# Altium project vending-pad-002.PrjPcb
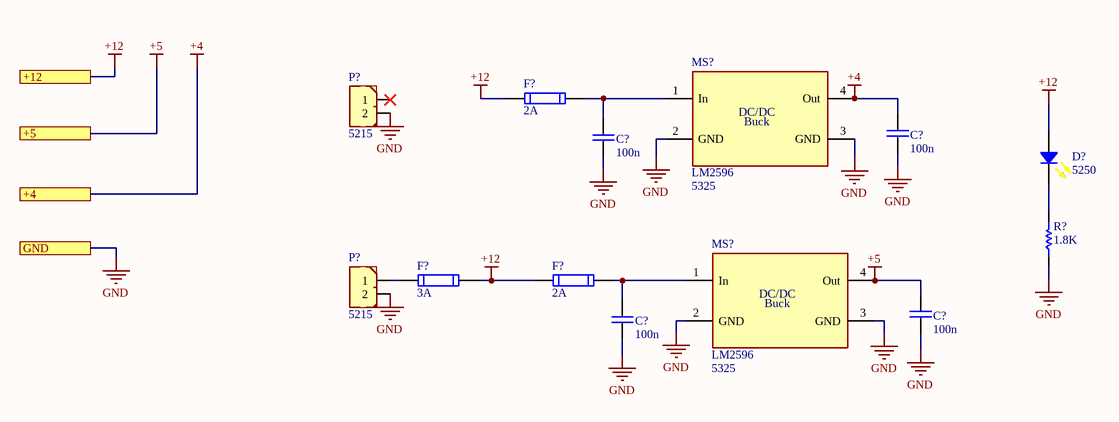
[diagram p0: Supply.SchDoc]
Revision: 1.0; Project_Name: vend_pad; CompanyName: rshahrami
6 sheets, 98 parts. Net scope: strictly hierarchical (ports join the sheet entries above them; power ports are local).
Board file: PCB.PcbDoc
Sheets:
  Supply.SchDoc
  GSM.SchDoc
  Motor.SchDoc
  GLCD.SchDoc
  Controller.SchDoc
  POS.SchDoc

## Sheet Supply.SchDoc
size A4; SheetNumber: 2; SheetTotal: 8; Time: Supply

### Parts
(Parts that share a designator on the sheet are numbered #1, #2 ... from top to bottom, then left to right.)
C?#1  100n  [CAP 1206/3216]
C?#2  100n  [CAP 1206/3216]
C?#3  100n  [CAP 1206/3216]
C?#4  100n  [CAP 1206/3216]
D?#1  Inflow: 5250  [LED 1206/3216 YELLOW]  (hidden comment: Yellow, 1206)
F?#1  2A  [1206_F]
F?#2  3A  [1206_F]
F?#3  2A  [1206_F]
MS?#1  Inflow: 5325  [LM2596_modsen]  (hidden comment: LM2596)
MS?#2  Inflow: 5325  [LM2596_modsen]  (hidden comment: LM2596)
P?#1  Inflow: 5215  [645002117322]  (hidden comment: 2'Pin)
P?#2  Inflow: 5215  [645002117322]  (hidden comment: 2'Pin)
R?#1  1.8K  [RES 1206 (3216X08L)]

### Ports
+4, +5, +12, GND

### Nets
+4: C?#2.1 MS?#1.4(Out) ; port +4
+5: C?#4.1 MS?#2.4(Out) ; port +5
+12: D?#1.1 F?#1.1 F?#2.2 F?#3.1 ; port +12
GND: C?#1.2 C?#2.2 C?#3.2 C?#4.2 MS?#1.2(GND) MS?#1.3(GND) MS?#2.2(GND) MS?#2.3(GND) P?#1.2 P?#2.2 R?#1.1 ; port GND
NetC?#1_1: C?#1.1 F?#1.2 MS?#1.1(In)
NetC?#3_1: C?#3.1 F?#3.2 MS?#2.1(In)
NetD?#1_2: D?#1.2 R?#1.2
NetF?#2_1: F?#2.1 P?#2.1

Not connected (* = marked no-connect by the designer): P?#1 1*

### Notes on the sheet
- Title:
- Project:
- Drawn by:
- Revision:
- Hossein Bagheri
- Company:
- Sheet
- of
- (in symbol ModSen_LM2596) DC/DC; Buck

### Library data of the parts
C?#1-C?#4 = Cap_Multi_SMD_100nF_1206: Bipolar ceramic capacitor SMD; Type: MultiLayer; Inflow: inflow?; Rating: 50V; Validation: Valid; Package: 1206; Value: 100n
D?#1 = Semi_LED_Yellow_1206: LED; Rating: Rating?; Type: Type?; Validation: Valid; Value: Yellow, 1206; Package: Package?
F?#1-F?#3 = Other_Elec_Fuse_SMD: Short circiut  protection; Inflow: inflow?; Type: Fast; Rating: Rating?; Validation: Valid; Package: 1206
  F?#1 F?#3: Value: 2A
  F?#2: Value: 3A
MS?#1 MS?#2 = ModSen_LM2596: DC to DC Buck converter 1.23V-30V 3A; Rating: Rating?; Validation: Valid; Package: Package?; Type: Type?; Value: LM2596
P?#1 P?#2 = Con_Power_2_PC_H: 2'Pin Power Connector; Rating: Rating?; Validation: Valid; Value: 2'Pin; Package: Package?; Type: Type?
R?#1 = Res_SMD_1206: Resistor; Inflow: inflow?; Rating: 0.25W; Validation: Valid; Package: 1206; Type: 10%; Value: 1.8K

## Sheet GSM.SchDoc
size A4; SheetNumber: 4; SheetTotal: 7
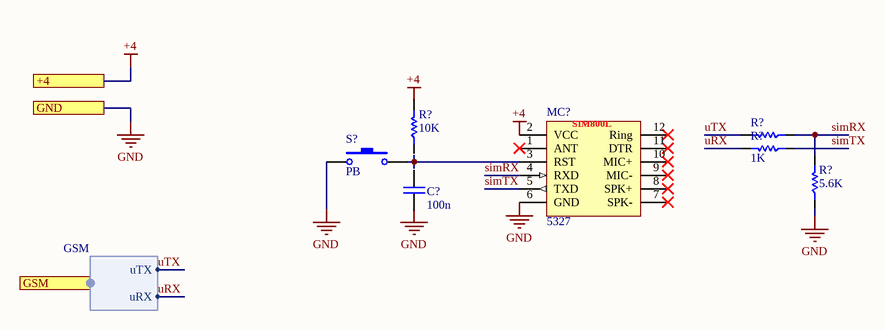
[diagram p1: GSM.SchDoc]

### Parts
(Parts that share a designator on the sheet are numbered #1, #2 ... from top to bottom, then left to right.)
C?#5  100n  [CAP 1206/3216]
MC?  Inflow: 5327  [Sim800L_Module]  (hidden comment: Sim800L)
R?#2  47K  [RES 1206 (3216X08L)]  (value not drawn)
R?#3  1K  [RES 1206 (3216X08L)]
R?#4  10K  [RES 1206 (3216X08L)]
R?#5  5.6K  [RES 1206 (3216X08L)]
S?#1  PB  [SW_PB_SMD_2PIN_SPST_6X3X2]

### Ports
+4, GND, GSM (harness GSM)

### Harnesses
GSM: uTX, uRX

### Nets
+4: MC?.2(VCC) ; port +4
GND: MC?.6(GND) R?#5.1 S?#1.2 ; port GND
simRX: MC?.4(RXD) R?#2.1 R?#5.2
simTX: MC?.5(TXD) R?#3.1
uRX: R?#3.2 ; port GSM.uRX
uTX: R?#2.2 ; port GSM.uTX
NetMC?_3: MC?.3(RST) S?#1.1

Not connected (* = marked no-connect by the designer): C?#5 1 2; MC? 1(ANT)* 7(SPK-)* 8(SPK+)* 9(MIC-)* 10(MIC+)* 11(DTR)* 12(Ring)*; R?#4 1 2

### Notes on the sheet
- Labels drawn without touching a wire or pin: +4, GND
- (in symbol ModSen_Com_Sim800L) SIM800L

### Library data of the parts
C?#5 = Cap_Multi_SMD_100nF_1206: as C?#1 on sheet Supply; Package: 1206; Value: 100n
MC? = ModSen_Com_Sim800L: SimCom GSM/GPRS Module; Rating: Rating?; Validation: NT; Value: Sim800L; Package: Dip; Type: GSM-GPRS
R?#2-R?#5 = Res_SMD_1206: as R?#1 on sheet Supply; Package: 1206; Type: 10%
  R?#2: Value: 47K
  R?#3: Value: 1K
  R?#4: Value: 10K
  R?#5: Value: 5.6K
S?#1 = SW_PushButton_2_SMD: SMT Tactile ‎Switch; Rating: 2b; Validation: Valid; Inflow: 8260; Type: Vertical; Package: SMD; Value: PB

## Sheet Motor.SchDoc
size A4; SheetNumber: 4; SheetTotal: 7
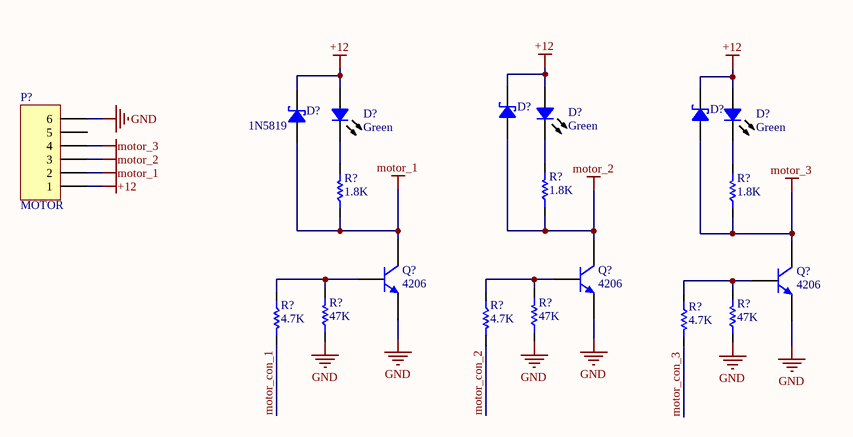
[diagram p2: Motor.SchDoc]

### Parts
(Parts that share a designator on the sheet are numbered #1, #2 ... from top to bottom, then left to right.)
D?#2  Green  [LED 0805/2012 GREEN]
D?#3  Green  [LED 0805/2012 GREEN]
D?#4  Green  [LED 0805/2012 GREEN]
D?#5  1N5819  [430X270D]
D?#6  1N5819  [430X270D]  (value not drawn)
D?#7  1N5819  [430X270D]  (value not drawn)
P?#3  MOTOR  [MO-Header 6]
Q?#1  Inflow: 4206  [TO-220 AB]  (hidden comment: NPN)
Q?#2  Inflow: 4206  [TO-220 AB]  (hidden comment: NPN)
Q?#3  Inflow: 4206  [TO-220 AB]  (hidden comment: NPN)
R?#6  1.8K  [RES 0805 (2012X06L)]
R?#7  1.8K  [RES 0805 (2012X06L)]
R?#8  1.8K  [RES 0805 (2012X06L)]
R?#9  4.7K  [RES 1206 (3216X08L)]
R?#10  4.7K  [RES 1206 (3216X08L)]
R?#11  4.7K  [RES 1206 (3216X08L)]
R?#12  47K  [RES 1206 (3216X08L)]
R?#13  47K  [RES 1206 (3216X08L)]
R?#14  47K  [RES 1206 (3216X08L)]

### Nets
+12: D?#2.1 D?#3.1 D?#4.1 D?#5.2 D?#6.2 D?#7.2 P?#3.1
GND: P?#3.6 Q?#1.3(E) Q?#2.3(E) Q?#3.3(E) R?#12.1 R?#13.1 R?#14.1
motor_1: D?#5.1 P?#3.2 Q?#1.2(C) R?#6.1
motor_2: D?#6.1 P?#3.3 Q?#2.2(C) R?#7.1
motor_3: D?#7.1 P?#3.4 Q?#3.2(C) R?#8.1
motor_con_1: R?#9.2
motor_con_2: R?#10.2
motor_con_3: R?#11.2
NetD?#2_2: D?#2.2 R?#6.2
NetD?#3_2: D?#3.2 R?#7.2
NetD?#4_2: D?#4.2 R?#8.2
NetQ?#1_1: Q?#1.1(B) R?#9.1 R?#12.2
NetQ?#2_1: Q?#2.1(B) R?#10.1 R?#13.2
NetQ?#3_1: Q?#3.1(B) R?#11.1 R?#14.2

Not connected (* = marked no-connect by the designer): P?#3 5

### Library data of the parts
D?#2-D?#4 = Semi_LED_SMD: LED; Inflow: inflow?; Rating: Rating?; Validation: Valid; Package: Package?; Type: LED; Value: Green
D?#5-D?#7 = Semi_Diod_Sch_1N5819_SMD: Schottky Rectifiers; Rating: Rating?; Validation: Valid; Inflow: inflow?; Package: SMA; Type: Schottky; Value: 1N5819
P?#3 = MO-Header 6
Q?#1-Q?#3 = Semi_BJT_TIP41C: NPN Power transistor; Rating: Rating?; Type: Type?; Validation: NT; Value: NPN; Package: Package?
R?#6-R?#8 = Res_SMD_0805: Resistor; Inflow: inflow?; Rating: 0.125W; Validation: Valid; Package: 0805; Type: 10%; Value: 1.8K
R?#9-R?#14 = Res_SMD_1206: as R?#1 on sheet Supply; Package: 1206; Type: 10%
  R?#9-R?#11: Value: 4.7K
  R?#12-R?#14: Value: 47K

## Sheet GLCD.SchDoc
size A4; SheetNumber: 5; SheetTotal: 7
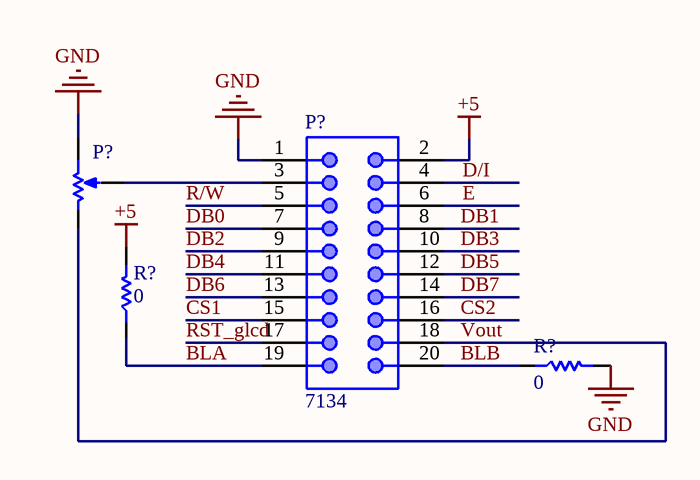
[diagram p3: GLCD.SchDoc]

### Parts
(Parts that share a designator on the sheet are numbered #1, #2 ... from top to bottom, then left to right.)
P?#4  Inflow: 7134  [BOX-HDR-10X2-2.54mm-S]  (hidden comment: 10x2)
P?#5  10K  [Multi turn 01]  (value not drawn)
R?#15  0  [RES 1206 (3216X08L)]
R?#16  0  [RES 1206 (3216X08L)]

### Nets
+5: P?#4.2 R?#15.2
GND: P?#4.1 P?#5.1 R?#16.2
BLA: P?#4.19 R?#15.1
BLB: P?#4.20 R?#16.1
CS1: P?#4.15
CS2: P?#4.16
D/I: P?#4.4
DB0: P?#4.7
DB1: P?#4.8
DB2: P?#4.9
DB3: P?#4.10
DB4: P?#4.11
DB5: P?#4.12
DB6: P?#4.13
DB7: P?#4.14
E: P?#4.6
R/W: P?#4.5
RST_glcd: P?#4.17
Vout: P?#4.18 P?#5.3
NetP?#4_3: P?#4.3 P?#5.2

### Library data of the parts
P?#4 = Con_IDC_10x2: Male Box Header, 20 pins; Rating: Rating?; Validation: NT; Value: 10x2; Package: Package?; Type: Type?
P?#5 = Res_Multi: Multi Turn; Rating: Rating?; Validation: Valid; Inflow: inflow?; Package: Package?; Type: Type?; Value: 10K
R?#15 R?#16 = Res_SMD_1206: as R?#1 on sheet Supply; Package: 1206; Type: 10%; Value: 0

## Sheet Controller.SchDoc
size A4; SheetNumber: 2; SheetTotal: 8
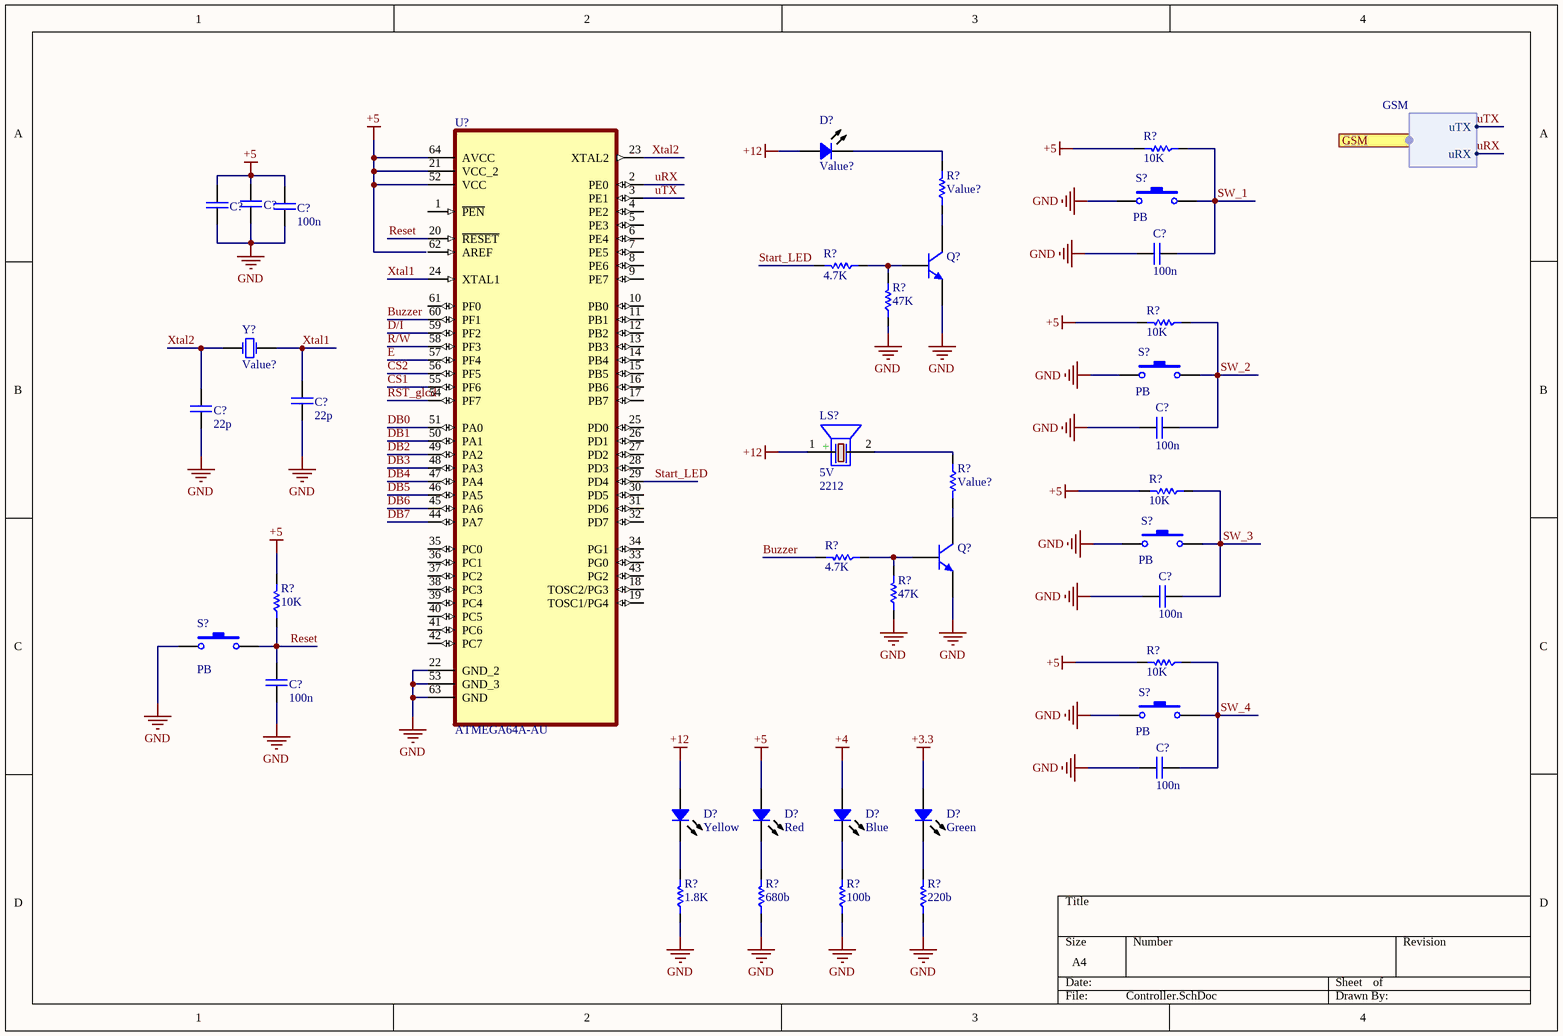
[diagram p4: Controller.SchDoc]

### Parts
(Parts that share a designator on the sheet are numbered #1, #2 ... from top to bottom, then left to right.)
C?#6  (no value)  [CAP 1206/3216]
C?#7  (no value)  [CAP 1206/3216]
C?#8  100n  [CAP 1206/3216]
C?#9  100n  [CAP 1206/3216]
C?#10  22p  [CAP 1206/3216]
C?#11  22p  [CAP 1206/3216]
C?#12  100n  [CAP 1206/3216]
C?#13  100n  [CAP 1206/3216]
C?#14  100n  [CAP 1206/3216]
C?#15  100n  [CAP 1206/3216]
D?#8  Value?  [LED 1206/3216 GREEN]
D?#9  Yellow  [LED 0805/2012 YELLOW]
D?#10  Red  [LED 0805/2012 RED]
D?#11  Blue  [LED 0805/2012 BLUE]
D?#12  Green  [LED 0805/2012 GREEN]
LS?  Inflow: 2212  [BZ_SJ]  (hidden comment: 5V)
Q?#4  NPN  [SOT23_N]  (value not drawn)
Q?#5  NPN  [SOT23_N]  (value not drawn)
R?#17  10K  [RES 1206 (3216X08L)]
R?#18  Value?  [RES 1206 (3216X08L)]
R?#19  4.7K  [RES 1206 (3216X08L)]
R?#20  10K  [RES 1206 (3216X08L)]
R?#21  47K  [RES 1206 (3216X08L)]
R?#22  Value?  [RES 1206 (3216X08L)]
R?#23  10K  [RES 1206 (3216X08L)]
R?#24  4.7K  [RES 1206 (3216X08L)]
R?#25  47K  [RES 1206 (3216X08L)]
R?#26  10K  [RES 1206 (3216X08L)]
R?#27  10K  [RES 1206 (3216X08L)]
R?#28  1.8K  [RES 0805 (2012X06L)]
R?#29  680b  [RES 0805 (2012X06L)]
R?#30  100b  [RES 0805 (2012X06L)]
R?#31  220b  [RES 0805 (2012X06L)]
S?#2  PB  [SW_PB_SMD_2PIN_SPST_6X3X2]
S?#3  PB  [SW_PB_SMD_2PIN_SPST_6X3X2]
S?#4  PB  [SW_PB_SMD_2PIN_SPST_6X3X2]
S?#5  PB  [SW_PB_SMD_2PIN_SPST_6X3X2]
S?#6  PB  [SW_PB_SMD_2PIN_SPST_6X3X2]
U?#1  ATMEGA64A-AU  [QFP80P1600X1600X120-64N]
Y?  Value?  [XTAL Small]

### Ports
GSM (harness GSM)

### Harnesses
GSM: uTX, uRX

### Nets
+3.3: D?#12.1
+4: D?#11.1
+5: C?#6.1 C?#7.1 C?#8.1 D?#10.1 R?#17.2 R?#20.2 R?#23.2 R?#26.2 R?#27.2 U?#1.21(VCC_2) U?#1.52(VCC) U?#1.64(AVCC)
+12: D?#8.1 D?#9.1 LS?.1(+)
GND: C?#6.2 C?#7.2 C?#8.2 C?#9.2 C?#10.2 C?#11.2 C?#12.2 C?#13.2 C?#14.2 C?#15.2 Q?#4.2(E) Q?#5.2(E) R?#21.1 R?#25.1 R?#28.1 R?#29.1 R?#30.1 R?#31.1 S?#2.1 S?#3.1 S?#4.1 S?#5.1 S?#6.1 U?#1.22(GND_2) U?#1.53(GND_3) U?#1.63(GND)
Buzzer: R?#24.2 U?#1.60(PF1)
CS1: U?#1.55(PF6)
CS2: U?#1.56(PF5)
D/I: U?#1.59(PF2)
DB0: U?#1.51(PA0)
DB1: U?#1.50(PA1)
DB2: U?#1.49(PA2)
DB3: U?#1.48(PA3)
DB4: U?#1.47(PA4)
DB5: U?#1.46(PA5)
DB6: U?#1.45(PA6)
DB7: U?#1.44(PA7)
E: U?#1.57(PF4)
R/W: U?#1.58(PF3)
Reset: C?#14.1 R?#26.1 S?#5.2 U?#1.20(~{RESET})
RST_glcd: U?#1.54(PF7)
Start_LED: R?#19.2 U?#1.29(PD4)
SW_1: C?#9.1 R?#17.1 S?#2.2
SW_2: C?#12.1 R?#20.1 S?#3.2
SW_3: C?#13.1 R?#23.1 S?#4.2
SW_4: C?#15.1 R?#27.1 S?#6.2
uRX: U?#1.2(PE0) ; port GSM.uRX
uTX: U?#1.3(PE1) ; port GSM.uTX
Xtal1: C?#10.1 U?#1.24(XTAL1) Y?.2(OSC2)
Xtal2: C?#11.1 U?#1.23(XTAL2) Y?.1(OSC1)
NetD?#8_2: D?#8.2 R?#18.2
NetD?#9_2: D?#9.2 R?#28.2
NetD?#10_2: D?#10.2 R?#29.2
NetD?#11_2: D?#11.2 R?#30.2
NetD?#12_2: D?#12.2 R?#31.2
NetLS?_2: LS?.2(-) R?#22.1
NetQ?#4_1: Q?#4.1(B) R?#19.1 R?#21.2
NetQ?#4_3: Q?#4.3(C) R?#18.1
NetQ?#5_1: Q?#5.1(B) R?#24.1 R?#25.2
NetQ?#5_3: Q?#5.3(C) R?#22.2

Not connected (* = marked no-connect by the designer): U?#1 1(~{PEN}) 4(PE2) 5(PE3) 6(PE4) 7(PE5) 8(PE6) 9(PE7) 10(PB0) 11(PB1) 12(PB2) 13(PB3) 14(PB4) 15(PB5) 16(PB6) 17(PB7) 18(TOSC2/PG3) 19(TOSC1/PG4) 25(PD0) 26(PD1) 27(PD2) 28(PD3) 30(PD5) 31(PD6) 32(PD7) 33(PG0) 34(PG1) 35(PC0) 36(PC1) 37(PC2) 38(PC3) 39(PC4) 40(PC5) 41(PC6) 42(PC7) 43(PG2) 61(PF0) 62(AREF)

### Library data of the parts
C?#6-C?#15 = Cap_Multi_SMD_100nF_1206: as C?#1 on sheet Supply; Package: 1206
  C?#8 C?#9 C?#12-C?#15: Value: 100n
  C?#10 C?#11: Value: 22p
D?#8-D?#12 = Semi_LED_SMD: as D?#2 on sheet Motor; Package: Package?; Type: LED
  D?#8: Value: Value?
  D?#9: Value: Yellow
  D?#10: Value: Red
  D?#11: Value: Blue
  D?#12: Value: Green
LS? = Other_Elec_Buzzer: Magnetic Transducer Buzzer; Rating: 12mm; Validation: Valid; Type: Buzzer; Package: Dip; Value: 5V
Q?#4 Q?#5 = Semi_BJT_BC817: NPN General purpose Transistor; Rating: Rating?; Type: Type?; Validation: Valid; Inflow: inflow?; Value: NPN; Package: Package?
R?#17-R?#27 = Res_SMD_1206: as R?#1 on sheet Supply; Package: 1206; Type: 10%
  R?#17 R?#20 R?#23 R?#26 R?#27: Value: 10K
  R?#18 R?#22: Value: Value?
  R?#19 R?#24: Value: 4.7K
  R?#21 R?#25: Value: 47K
R?#28-R?#31 = Res_SMD_0805: as R?#6 on sheet Motor; Package: 0805; Type: 10%
  R?#28: Value: 1.8K
  R?#29: Value: 680b
  R?#30: Value: 100b
  R?#31: Value: 220b
S?#2-S?#6 = SW_PushButton_2_SMD: as S?#1 on sheet GSM; Type: Vertical; Package: SMD; Value: PB
U?#1 = ATMEGA64A-AU: AVR AVRÂ® ATmega Microcontroller IC 8-Bit 16MHz 64KB (32K x 16) FLASH 64-TQFP (14x14); MF: Microchip; SnapEDA_Link: https://www.snapeda.com/parts/ATMEGA64A-AU/Microchip/view-part/?ref=snap; Package: TQFP-64 Microchip; Value: *; MP: ATMEGA64A-AU; Check_prices: https://www.snapeda.com/parts/ATMEGA64A-AU/Microchip/view-part/?ref=eda
Y? = Other_Elec_Xtal_THT: Crystal Oscillator; Rating: Rating?; Inflow: inflow?; Validation: Valid; Type: Quartz; Package: Dip; Value: Value?

## Sheet POS.SchDoc
size A4; SheetNumber: 7; SheetTotal: 7
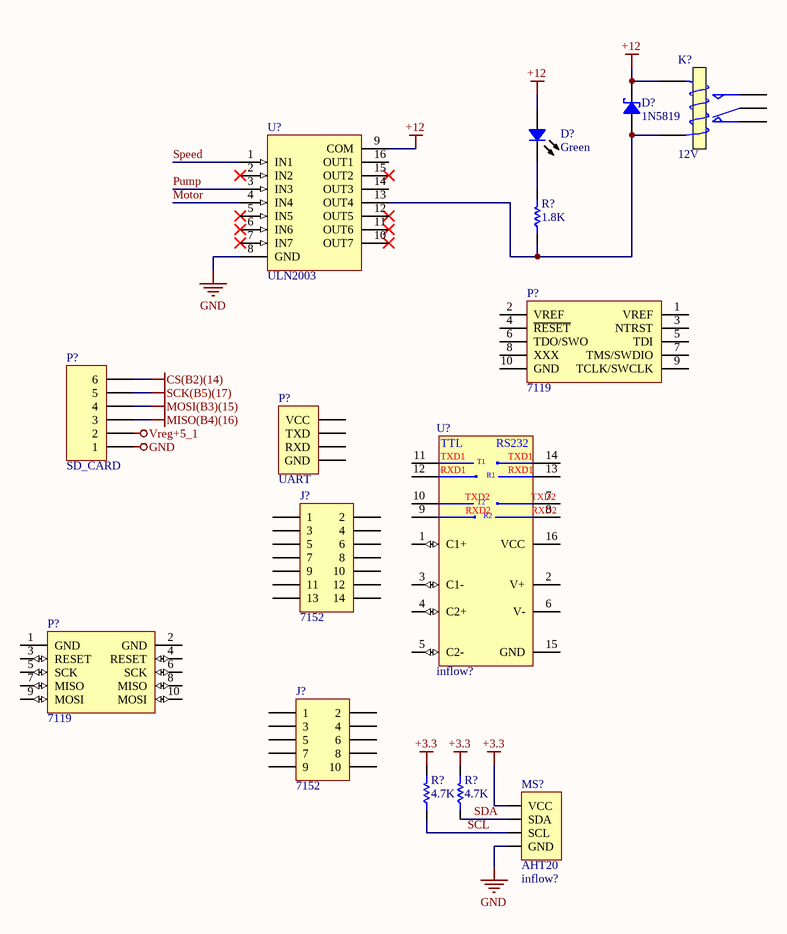
[diagram p5: POS.SchDoc]

### Parts
(Parts that share a designator on the sheet are numbered #1, #2 ... from top to bottom, then left to right.)
D?#13  Green  [LED 0805/2012 GREEN]
D?#14  1N5819  [430X270D]
J?#1  Inflow: 7152  [HDR_THT_7x2M_2.54mm]  (hidden comment: 7x2)
J?#2  Inflow: 7152  [HDR_THT_5x2M_2.54mm]  (hidden comment: 5x2)
K?  12V  [Relay 18.85x15.35x15.70]
MS?#3  Inflow: inflow?  [AHT20]  (hidden comment: AHT20)
P?#6  Inflow: 7119  [IDC2.54-10PIN]  (hidden comment: JTAG-10P)
P?#7  UART  [MOLEX KK 0022272041]
P?#8  SD_CARD  [MO-Header 6]
P?#9  Inflow: 7119  [IDC2.54-10PIN]  (hidden comment: JTAG, 10'Pin)
R?#32  1.8K  [RES 0805 (2012X06L)]
R?#33  4.7K  [RES 0805 (2012X06L)]
R?#34  4.7K  [RES 0805 (2012X06L)]
U?#2  ULN2003  [SO16_M]
U?#3  Inflow: inflow?  [NSO16_M]  (hidden comment: MAX3232)

### Nets
+3.3: MS?#3.4(VCC) R?#33.2 R?#34.2
+12: D?#13.1 D?#14.2 K?.5(T2) U?#2.9(COM)
CS(B2)(14): P?#8.6
GND: MS?#3.3(GND) P?#8.1 U?#2.8(GND)
MISO(B4)(16): P?#8.3
MOSI(B3)(15): P?#8.4
SCK(B5)(17): P?#8.5
Vreg+5_1: P?#8.2
Motor: U?#2.4(IN4)
Pump: U?#2.3(IN3)
SCL: MS?#3.2(SCL) R?#33.1
SDA: MS?#3.1(SDA) R?#34.1
Speed: U?#2.1(IN1)
NetD?#13_2: D?#13.2 R?#32.2
NetD?#14_1: D?#14.1 K?.4(T1) R?#32.1 U?#2.13(OUT4)

Not connected (* = marked no-connect by the designer): J?#1 1 2 3 4 5 6 7 8 9 10 11 12 13 14; J?#2 1 2 3 4 5 6 7 8 9 10; K? 1(COM) 2(NC) 3(NO); P?#6 1(VREF) 2(VREF) 3(NTRST) 4(~{RESET}) 5(TDI) 6(TDO/SWO) 7(TMS/SWDIO) 8(XXX) 9(TCLK/SWCLK) 10(GND); P?#7 1(VCC) 2(TXD) 3(RXD) 4(GND); P?#9 1(GND) 2(GND) 3(RESET) 4(RESET) 5(SCK) 6(SCK) 7(MISO) 8(MISO) 9(MOSI) 10(MOSI); U?#2 2(IN2)* 5(IN5)* 6(IN6)* 7(IN7)* 10(OUT7)* 11(OUT6)* 12(OUT5)* 14(OUT3) 15(OUT2)* 16(OUT1); U?#3 1(C1+) 2(V+) 3(C1-) 4(C2+) 5(C2-) 6(V-) 7(T2OUT) 8(R2IN) 9(R2OUT) 10(T2IN) 11(T1IN) 12(R1OUT) 13(R1IN) 14(T1OUT) 15(GND) 16(VCC)

### Notes on the sheet
- (in symbol IC_Converter_MAX3232CSE) TTL; TXD1; T1; RXD1; R1; TXD2; T2; RXD2; R2

### Library data of the parts
D?#13 = Semi_LED_SMD: as D?#2 on sheet Motor; Package: Package?; Type: LED; Value: Green
D?#14 = Semi_Diod_Sch_1N5819_SMD: as D?#5 on sheet Motor; Package: SMA; Type: Schottky; Value: 1N5819
J?#1 = Con_MPH_7x2_V_THT_2.54: Header, dual row, 14 pin; Rating: Rating?; Validation: NT; Value: 7x2; Package: Package?; Type: Type?
J?#2 = Con_MPH_5x2_V_THT_2.54: Header, dual row, 10 pin; Rating: Rating?; Validation: NT; Value: 5x2; Package: Package?; Type: Type?
K? = SW_Relay_SPDT: SPDT Relay; Rating: Rating?; Validation: Valid; Inflow: inflow?; Type: SPDT; Package: Dip; Value: 12V
MS?#3 = ModSen_AHT20: Air Temperature and Humidity Sensor; Rating: Rating?; Validation: NT; Package: Dip; Type: Air T&H; Value: AHT20
P?#6 = Con_Prog_JTAG_10: 10 Pin Standard JTAG Header For ARM JLINK; Rating: Rating?; Validation: NT; Value: JTAG-10P; Package: Package?; Type: Type?
P?#7 = Con_UART: UART Connector; Rating: Rating?; Validation: Valid; Inflow: 4528; Package: Package?; Type: Type?; Value: UART
P?#8 = MO-Header 6
P?#9 = Con_Prog_USBasp: 10 Pin Standard ISP Header For TNM; Rating: Rating?; Validation: Valid; Value: JTAG, 10'Pin; Package: Package?; Type: Type?
R?#32-R?#34 = Res_SMD_0805: as R?#6 on sheet Motor; Package: 0805; Type: 10%
  R?#32: Value: 1.8K
  R?#33 R?#34: Value: 4.7K
U?#2 = IC_Driver_ULN2003: Seven darlington array drivers; Rating: Rating?; Validation: Valid; Inflow: 1506; Package: SO-16; Type: Driver; Value: ULN2003
U?#3 = IC_Converter_MAX3232CSE: RS-232 Interface IC 3.0V to 5.5V, Low-Power, up to 1Mbps, True RS-232 Transceivers Using Four 0.1uF External Capacitors; Rating: Rating?; Validation: Valid; Value: MAX3232; Package: SOIC-16; Type: RS232